# EAGLE design chipset (EAGLE 9.2.2)
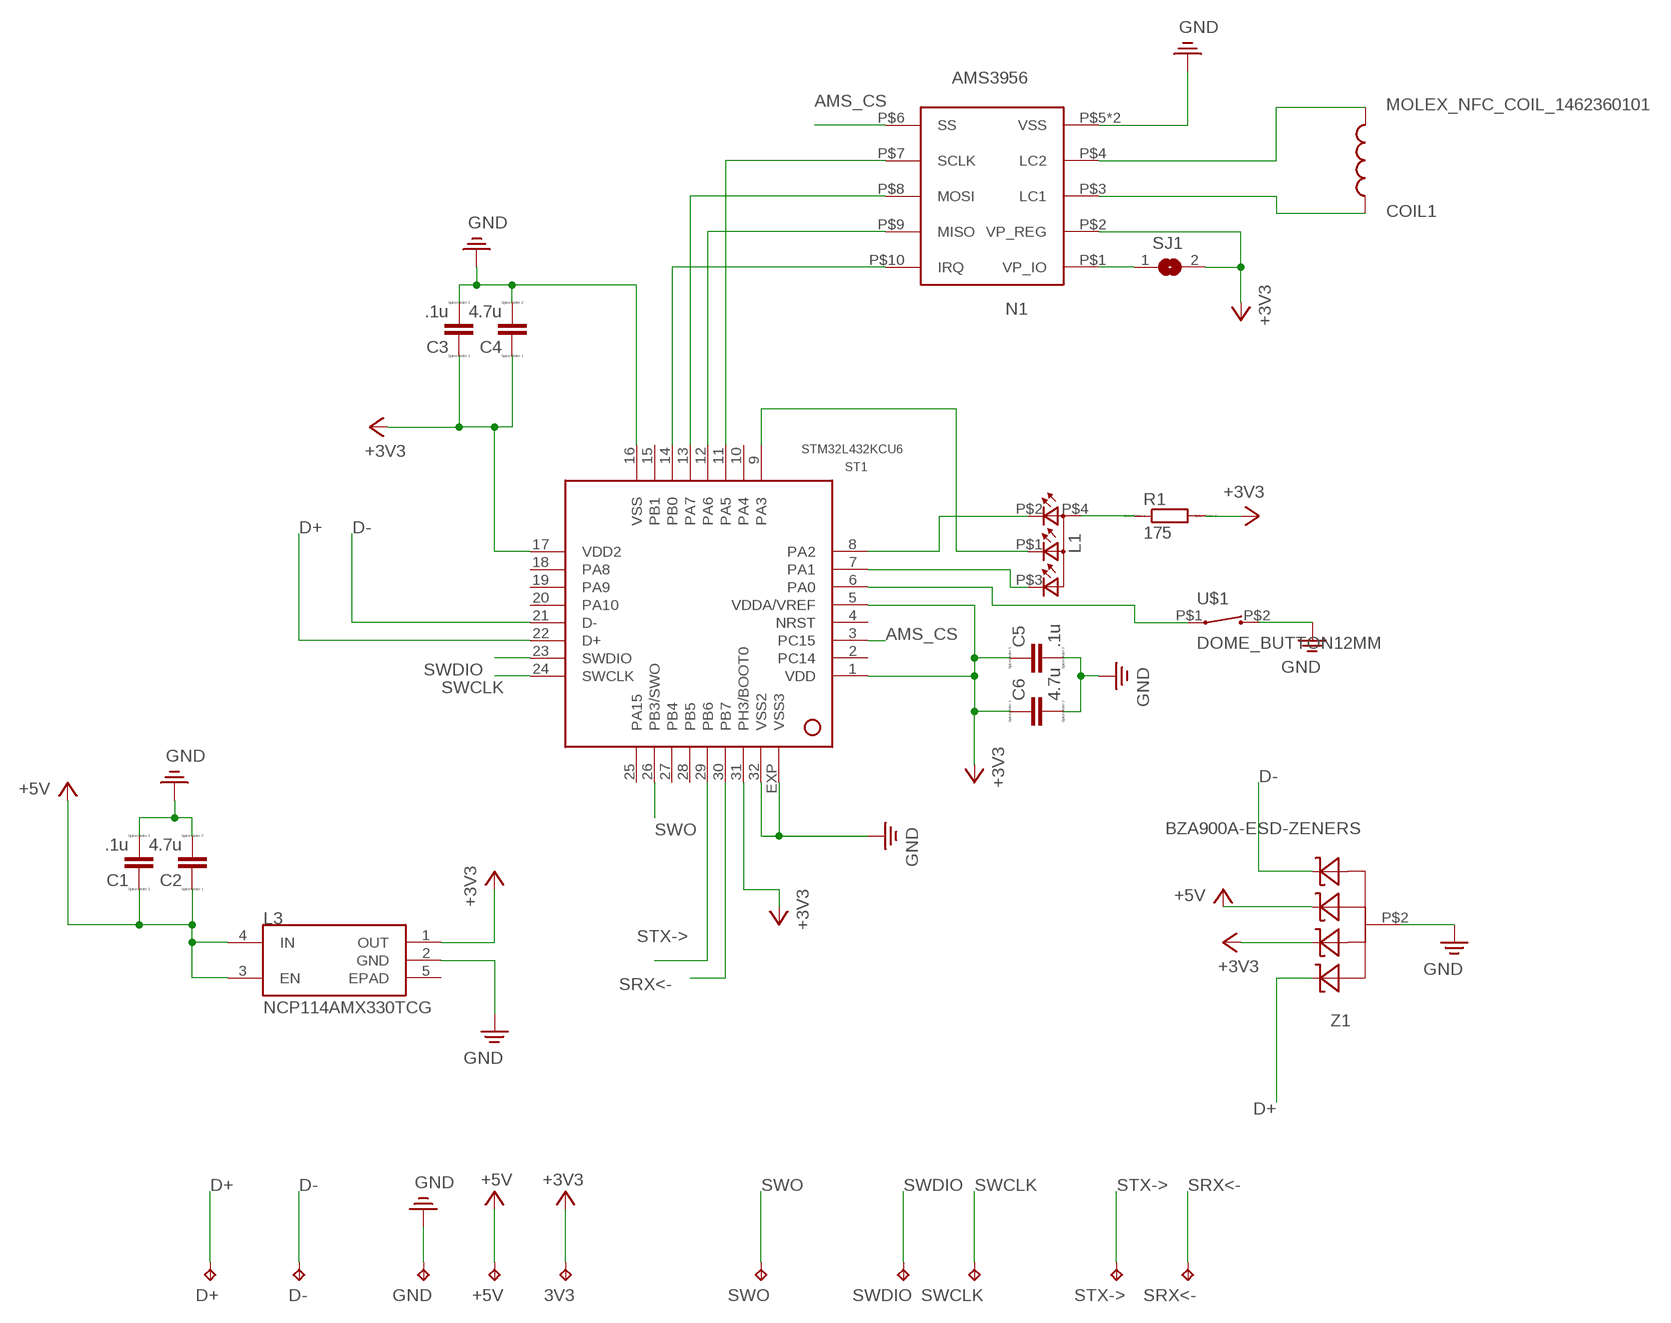
[diagram p0: schematic, sheet 1]

## Parts
3V3  TEST_POINT  [B1,27]
+5V  TEST_POINT  [B1,27]
C1  .1u  CAPACITOR  [C0402]
C2  4.7u  CAPACITOR  [C0402]
C3  .1u  CAPACITOR  [C0402]
C4  4.7u  CAPACITOR  [C0402]
C5  .1u  CAPACITOR  [C0402]
C6  4.7u  CAPACITOR  [C0402]
COIL1  MOLEX_NFC_COIL_1462360101  [MOLEX_NFC_COIL1]
D+  TEST_POINT  [B1,27]
D-  TEST_POINT  [B1,27]
GND  TEST_POINT  [B1,27]
L1  EAST1616RGBA3-LED-RGBCL-505S-X-SD-T  [CL-505S-X-SD-T]
L3  NCP114AMX330TCG  [REG_NCP114AMX330TCG]
N1  AMS3956  [MLPD3X3]
R1  175  RESISTOR  [R0402]
SJ1  SJ  [SJ]
SRX<-  TEST_POINT  [B1,27]
ST1  STM32L432KCU6  [QFN32]
STX->  TEST_POINT  [B1,27]
SWCLK  TEST_POINT  [B1,27]
SWDIO  TEST_POINT  [B1,27]
SWO  TEST_POINT  [B1,27]
U$1  DOME_BUTTON12MM  [DOME-BL-12MM]
Z1  BZA900A-ESD-ZENERS  [BZA900A]

## Nets
+3V3: 3V3.TP C3.1 C4.1 C5.1 C6.1 L3.1(OUT) N1.P$2(VP_REG) R1.2 SJ1.2 ST1.1(VDD) ST1.5(VDDA/VREF) ST1.17(VDD2) ST1.31(PH3/BOOT0) Z1.P$5(C1)
+5V: +5V.TP C1.1 C2.1 L3.3(EN) L3.4(IN) Z1.P$1(C)
AMS_CS: N1.P$6(SS) ST1.3(PC15)
D+: D+.TP ST1.22(D+) Z1.P$3(C3)
D-: D-.TP ST1.21(D-) Z1.P$4(C2)
N$1: L1.P$3(CGREEN) ST1.7(PA1)
N$2: L1.P$1(CBLUE) ST1.9(PA3)
N$3: L1.P$2(CRED) ST1.8(PA2)
N$5: ST1.6(PA0) U$1.P$1
N$6: L1.P$4(A2) R1.1
N$7: N1.P$1(VP_IO) SJ1.1
N$8: N1.P$7(SCLK) ST1.11(PA5)
N$9: N1.P$8(MOSI) ST1.13(PA7)
N$10: N1.P$9(MISO) ST1.12(PA6)
N$11: N1.P$10(IRQ) ST1.14(PB0)
N$12: COIL1.P$2 N1.P$4(LC2)
N$13: COIL1.P$1 N1.P$3(LC1)
PE: C1.2 C2.2 C3.2 C4.2 C5.2 C6.2 GND.TP L3.2(GND) N1.P$5(VSS) N1.P$11(VSS) ST1.16(VSS) ST1.32(VSS2) ST1.EXP(VSS3) U$1.P$2 Z1.P$2 ; supply symbol labelled GND
SRX<-: SRX<-.TP ST1.30(PB7)
STX->: ST1.29(PB6) STX->.TP
SWCLK: ST1.24(SWCLK) SWCLK.TP
SWDIO: ST1.23(SWDIO) SWDIO.TP
SWO: ST1.26(PB3/SWO) SWO.TP
Unconnected: L3.5(EPAD) ST1.2(PC14) ST1.4(NRST) ST1.10(PA4) ST1.15(PB1) ST1.18(PA8) ST1.19(PA9) ST1.20(PA10) ST1.25(PA15) ST1.27(PB4) ST1.28(PB5)

## Library data of the parts
3V3 +5V D+ D- GND SRX<- STX-> SWCLK SWDIO SWO = efm-fido:TEST_POINT
C1-C6 = efm-fido:CAPACITOR
COIL1 = efm-fido:MOLEX_NFC_COIL_1462360101; LINK: https://www.mouser.com/ProductDetail/538-146236-0101; MPN: 1462360101
L1 = efm-fido:EAST1616RGBA3-LED-RGB: EAST1616RGBA3
L3 = efm-fido:NCP114AMX330TCG: CMOS Low Dropout Regulator, 300 mA 3.3V, Active Discharge; AVAILABILITY: Unavailable; DESCRIPTION: CMOS Low Dropout Regulator _LDO_, 300 mA 3.3V, Active Discharge; MF: ON Semiconductor; MP: NCP114AMX330TCG; PACKAGE: UDFN-4 ON Semiconductor; PRICE: None
N1 = efm-fido:AMS3956
R1 = efm-fido:RESISTOR
SJ1 = jumper:SJ: SMD solder JUMPER
ST1 = efm-fido:STM32L432KCU6
U$1 = efm-fido:DOME_BUTTON
Z1 = efm-fido:BZA900A-ESD-ZENERS

## Net classes
0 default: width 0.152 mm, drill 0.203 mm, clearance 0.102 mm

## Board
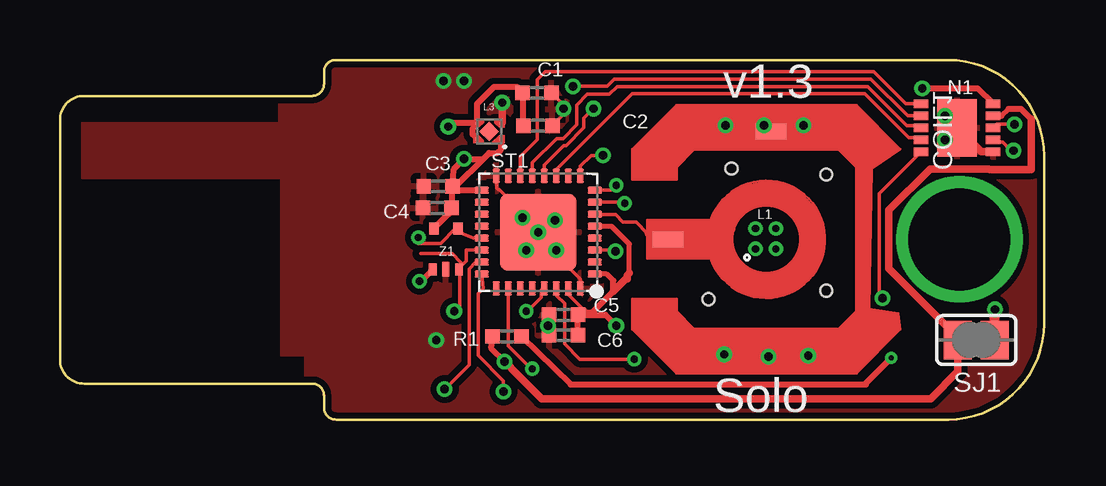
[diagram p1: board, top side]
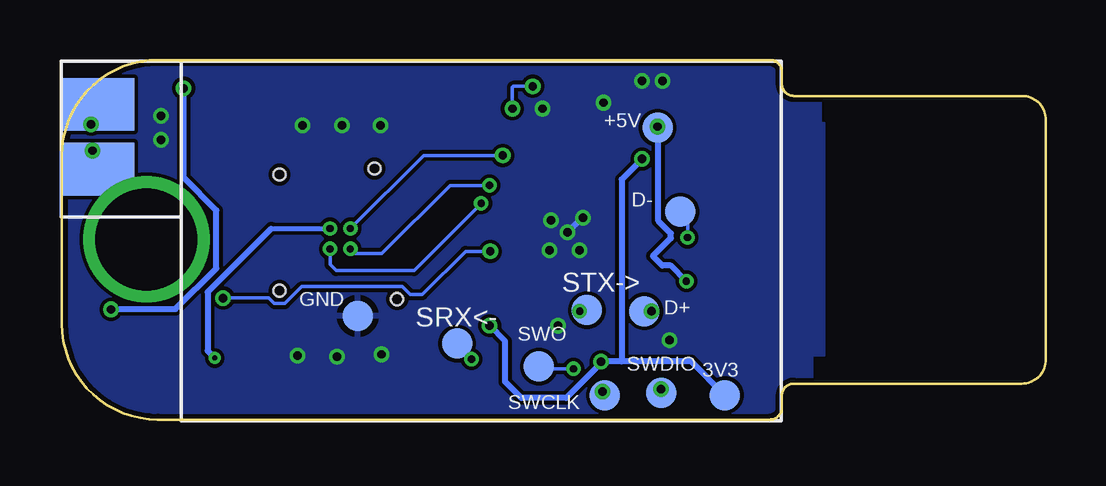
[diagram p2: board, bottom side, seen from below]

Size 41 x 15 mm. Coordinates in mm from the lower left corner, seen from the top.
Outline: 0,2.5 0,12.5 arc-90 1,13.5 10.5,13.5 arc90 11,14 11,14.5 arc-90 11.5,15 37,15 arc-90 41,11 41,4 arc-90 37,0 11.5,0 arc-90 11,0.5 11,1 arc90 10.5,1.5 1,1.5 arc-90 0,2.5
Copper layers (1*16): Top 0.035mm / dielectric 2.2mm / Bottom 0.035mm
Design rules "default *": minimum track width 4mil, minimum drill 0.2mm, track to track 6mil, track to pad 6mil, pad to pad 6mil, via to via 6mil, smd to smd 6mil, copper to edge 8mil, drill to drill 6mil, minimum pad ring 10mil, minimum via ring 0.15mm, stop-mask expansion 4mil, vias tented up to drill 0mil, thermal gap 10mil
Holes 0.5 mm at 27.03,5.02 31.93,5.37 31.93,10.22 27.98,10.47

### Footprints (pad centres in the part's own frame; a part is rotated, then mirrored left to right if it is on the bottom)
B1,27 = smd 1.27 x 1.27: TP 0,0
C0402 = smd 0.6 x 0.6: 1 -0.6,0; 2 0.6,0
MOLEX_NFC_COIL1 = smd 2.2 x 3.1: P$1 13.43,28.5; P$2 10.73,28.5
CL-505S-X-SD-T = smd 0.4 x 0.4: P$1 0.85,0; P$2 0.85,0.85; P$3 0,0.85; P$4 0,0
REG_NCP114AMX330TCG = smd 0.1 x 0.1: 1 -0.325,-0.5; 2 0.325,-0.5; 3 0.325,0.5; 4 -0.325,0.5 | smd 0.58 x 0.58 rotated 45: 5 0,0
MLPD3X3 = smd 0.35 x 0.6: P$1 0,0; P$2 0.5,0; P$3 1,0; P$4 1.5,0; P$5 2,0; P$6 2,-3; P$7 1.5,-3; P$8 1,-3; P$9 0.5,-3; P$10 0,-3 | smd 2.38 x 1.65: P$11 1,-1.5
R0402 = smd 0.6 x 0.6: 1 -0.6,0; 2 0.6,0
SJ = smd 1.168 x 1.6: 1 -0.762,0; 2 0.762,0
QFN32 = smd 0.6 x 0.3: 1 -2.35,1.75; 2 -2.35,1.25; 3 -2.35,0.75; 4 -2.35,0.25; 5 -2.35,-0.25; 6 -2.35,-0.75; 7 -2.35,-1.25; 8 -2.35,-1.75; 17 2.35,-1.75; 18 2.35,-1.25; 19 2.35,-0.75; 20 2.35,-0.25; 21 2.35,0.25; 22 2.35,0.75; 23 2.35,1.25; 24 2.35,1.75 | smd 0.3 x 0.6: 9 -1.75,-2.35; 10 -1.25,-2.35; 11 -0.75,-2.35; 12 -0.25,-2.35; 13 0.25,-2.35; 14 0.75,-2.35; 15 1.25,-2.35; 16 1.75,-2.35; 25 1.75,2.35; 26 1.25,2.35; 27 0.75,2.35; 28 0.25,2.35; 29 -0.25,2.35; 30 -0.75,2.35; 31 -1.25,2.35; 32 -1.75,2.35 | smd 3.2 x 3.2: EXP 0,0
DOME-BL-12MM = smd 1.27 x 0.635: P$1 -4.1,0; P$2 0.2,4.5
BZA900A = smd 0.325 x 0.5: P$1 -0.05,0; P$3 1.05,0 | smd 0.3 x 0.6: P$2 0.5,0 | smd 0.4 x 0.5: P$4 1,1.7; P$5 0,1.7

### Placement (x,y rotation side)
3V3  13.38,1.02 0 bottom
+5V  16.18,12.17 0 bottom
C1  19.88,13.63 0 top
C2  19.92,12.26 0 top
C3  15.76,9.73 180 top
C4  15.72,8.83 180 top
C5  20.98,4.37 180 top
C6  20.98,3.52 180 top
COIL1  11.03,-0.28 90 bottom
D+  16.73,4.52 0 bottom
D-  15.23,8.67 0 bottom
GND  28.68,4.32 0 bottom
L1  29.83,7.97 180 top
L3  17.88,12.02 90 top
N1  38.88,13.17 270 top
R1  18.63,3.47 180 top
SJ1  38.18,3.32 180 top
SRX<-  24.53,3.17 0 bottom
ST1  19.93,7.82 180 top
STX->  19.13,4.57 0 bottom
SWCLK  18.38,1.02 0 bottom
SWDIO  16.03,1.12 0 bottom
SWO  21.13,2.22 0 bottom
U$1  29.43,7.52 0 top
Z1  15.58,6.27 0 top

### Tracks (layer width: path | path; a pad name or v marks a point on that pad's centre or on a via)
+3V3  (via drill 0.35)
  Top 0.152: 21.11,5.45 ST1.31 21.18,5.22 21.83,4.57
  Top 0.203: 22.23,4.47 22.18,4.47 | 23.05,5.79 22.78,6.07 ST1.1 | ST1.5 22.98,8.07 23.73,7.32 23.73,6.12 | 39.23,12.67 39.53,12.97
  Top 0.254: 17.88,3.37 R1.2 17.98,2.97 v18.53,2.42 | C3.1 16.57,9.57 ST1.17 | 17.63,10.87 16.49,9.73 C3.1 | L3.1 18.38,11.27 18.23,11.12 17.88,11.12 17.63,10.87 | C3.1 16.41,10.45 v16.83,10.87 17.63,10.87 | C3.1 16.37,9.69 C4.1 16.37,8.65 16.18,8.57 Z1.P$5 | 23.05,5.79 23.05,5.34 22.18,4.47 21.73,4.47 | 21.73,4.47 21.83,4.57 | 21.73,4.47 21.68,4.42 C5.1 | C5.1 22.73,4.37 v23.18,3.92 | C6.1 C5.1 | 38.91,12.7 N1.P$2 39.23,12.67 | 39.53,12.97 40.03,12.97 40.47,12.53
  Top 0.305: 23.05,5.34 23.58,5.87 23.63,5.87 23.63,6.02 23.73,6.12 | v18.53,2.42 19.07,1.87 20.07,0.87 36.28,0.87 37.42,2.01 SJ1.2 37.42,3.42 34.54,6.3 34.54,8.73 36.26,10.46 38.69,10.46 38.73,10.42 40.47,10.42 40.47,12.53
  Bottom 0.254: 17.68,2.42 14.78,2.42 3V3.TP | 17.68,2.42 v18.53,2.42 18.53,2.37 19.99,0.9 21.86,0.9 22.53,1.57 22.53,3.27 v23.18,3.92 | v16.83,10.87 17.68,10.02 17.68,2.42
+5V  (via drill 0.3, 0.35)
  Top 0.152: 17.38,12.4 17.38,12.37 L3.3 17.38,12.3
  Top 0.203: C1.1 19.22,13.62 | 17.38,11.75 L3.4 17.43,11.64
  Top 0.254: L3.4 17.38,11.71 17.19,11.9 17.19,12.13 17.38,12.32 17.38,12.37 17.38,13.17 18.08,13.87 19.04,13.87 C1.1 19.28,12.3 C2.1 | L3.3 17.35,12.37 16.33,12.37 v16.18,12.22 | Z1.P$1 15.08,5.77 v14.98,5.77
  Bottom 0.152: +5V.TP v16.18,12.22
  Bottom 0.254: 16.33,12.07 v16.18,12.22 16.14,12.18 16.14,8.28 15.63,7.77 15.63,7.57 16.38,6.82 15.98,6.42 15.63,6.42 v14.98,5.77
AMS_CS  (via drill 0.35)
  Top 0.152: N1.P$6 34.13,9.42 34.13,5.22 v34.28,5.07 | v23.15,7.02 23.1,7.07 ST1.3
  Bottom 0.152: v34.28,5.07 32.38,5.07 32.15,4.84 31.71,4.84 31,5.55 26.81,5.55 26.48,5.22 25.98,5.22 24.18,7.02 v23.15,7.02
D+  (via drill 0.35)
  Top 0.152: ST1.22 16.93,7.07 16.93,6.62 16.63,6.32 Z1.P$3 | Z1.P$3 16.66,6.26 16.66,4.75 v16.43,4.52 | 15.03,6.92 16.35,6.92 16.71,6.56 16.71,6.35 Z1.P$3
  Bottom 0.254: D+.TP v16.43,4.52
D-  (via drill 0.3)
  Top 0.152: ST1.21 17.22,7.57 16.8,7.74 Z1.P$4 16.48,7.97 15.85,7.34 14.93,7.34 v14.93,7.59
  Bottom 0.152: v14.93,7.59 14.93,8.37 D-.TP
N$1  (via drill 0.3)
  Top 0.152: ST1.7 23.48,9.07 v23.53,9.02
  Bottom 0.152: v23.53,9.02 26.33,6.22 29.58,6.22 29.83,6.47 L1.P$3
  other vias: 29.83,7.12
N$2  (via drill 0.3, 0.35)
  Top 0.152: v22.63,11.02 22.13,11.02 21.68,10.57 ST1.9
  Bottom 0.152: v22.63,11.02 25.93,11.02 L1.P$1
  other vias: 28.98,7.97
N$3  (via drill 0.3)
  Top 0.152: ST1.8 22.98,9.57 v23.18,9.77
  Bottom 0.152: v23.18,9.77 24.83,9.77 27.68,6.92 28.83,6.92 28.88,6.97 28.88,7.02 L1.P$2
  other vias: 28.98,7.12
N$4  (via drill 4.25)
  other vias: 37.48,7.52
N$5
  Top 0.152: ST1.6 22.25,8.55 23.15,8.55 23.45,8.24 24,8.24 24.47,7.76 25.34,7.76 | 24.63,7.47 24.65,7.49 24.7,7.49 24.75,7.49 24.72,7.52 | U$1.P$1 24.72,7.52 | 24.72,7.52 24.7,7.54
  Top 0.254: 24.47,7.76 24.7,7.54 24.7,7.49
N$6  (via drill 0.2, 0.3)
  Top 0.152: L1.P$4 29.93,7.97
  Top 0.254: R1.1 21.28,1.47 33.58,1.47 33.58,1.52 v34.63,2.57
  Bottom 0.2: 32.28,7.97 L1.P$4
  Bottom 0.254: v34.63,2.57 34.93,2.87 34.93,5.32 32.28,7.97
  other vias: 29.83,7.97
N$7  (via drill 0.35)
  Top 0.254: v35.93,13.82 38.23,13.82 N1.P$1
  Top 0.406: SJ1.1 38.94,4.58 v38.95,4.59
  Bottom 0.254: v35.93,13.82 35.93,10.09 34.57,8.72 34.57,6.31 36.27,4.61 v38.94,4.61 v38.95,4.59
N$8
  Top 0.152: N1.P$7 35.78,11.76 35.36,11.76 33.53,13.59 23.84,13.59 20.68,10.43 ST1.11
N$9
  Top 0.152: N1.P$8 35.78,12.26 35.29,12.26 33.66,13.9 23.22,13.9 22.89,13.57 21.98,13.57 21.53,13.12 21.53,12.29 20.96,11.73 20.69,11.73 19.68,10.72 ST1.13
N$10  (via drill 0.35)
  Top 0.152: N1.P$9 35.31,12.67 33.78,14.2 23.09,14.2 22.79,13.9 v21.38,13.9 | v22.23,12.97 21.83,12.57 21.83,12.17 21.09,11.42 20.98,11.42 20.18,10.62 ST1.12
  Bottom 0.152: v21.38,13.9 22.19,13.9 22.23,13.87 v22.23,12.97
N$11
  Top 0.152: N1.P$10 35.25,13.17 33.91,14.51 20.22,14.51 19.89,14.18 19.89,11.68 19.18,10.97 ST1.14
N$12  (via drill 0.35)
  Top 0.152: N1.P$4 38.97,11.57 39.27,11.57 39.58,11.27 39.68,11.27 v39.73,11.22
  Bottom 0.152: v39.73,11.22 39.68,11.17 39.68,10.6 COIL1.P$2
N$13  (via drill 0.35)
  Top 0.152: v39.78,12.32 39.03,12.32 N1.P$3
  Bottom 0.152: v39.78,12.32 39.53,12.57 COIL1.P$1
PE  (via drill 0.35)
  Top 0.152: ST1.32 21.68,5.87 20.23,7.32 20.23,7.52 | ST1.16 18.2,10.1 18.2,9.65 18.26,9.59 18.31,9.59 19.93,7.97 ST1.EXP | C6.2 v20.33,3.92 | L3.2 18.43,12.39 | C2.2 20.97,12.71 v20.97,12.97 20.97,13.13 C1.2 | N1.P$11 37.88,12.67 | N1.P$11 v36.88,12.67 | N1.P$11 v36.88,11.67
  Top 0.254: v19.28,8.42 19.33,8.42 ST1.EXP 20.23,7.52 v20.68,7.07 | v20.63,8.32 19.43,8.32 v19.43,7.07 | v20.33,3.92 C5.2
  Top 0.305: N1.P$11 38.38,11.17 N1.P$5 | 18.43,12.39 v18.43,13.22
  Bottom 0.254: 20.03,7.82 ST1.EXP 19.33,8.42 v19.28,8.42
  other vias: 19.93,7.82 27.73,12.27 29.33,12.27 30.98,12.27 27.68,2.72 29.53,2.62 31.18,2.67 16.83,14.12 15.98,14.12 15.68,3.32
  pour Top (isolate 0.254): 0.93,10.07 0.93,12.37 9.13,12.37 9.13,18.07 41.83,18.07 41.83,-1.03 10.23,-1.03 10.23,2.67 9.23,2.67 9.23,10.07
  pour Bottom: 9.23,12.37 9.38,12.37 9.38,16.97 42.63,16.97 42.63,-1.73 9.73,-1.73 9.73,2.67 9.23,2.67
SRX<-  (via drill 0.3)
  Top 0.152: ST1.30 20.7,5.5 20.7,5.17 21.02,4.84 21.02,3.15 21.65,2.52 v23.93,2.52
  Bottom 0.152: v23.93,2.52 24.53,3.12 SRX<-.TP
STX->  (via drill 0.3)
  Top 0.152: ST1.29 20.06,5.4 20.06,5.1 19.48,4.52 v19.43,4.52 19.32,4.42
  Bottom 0.152: STX->.TP 19.18,4.52 v19.43,4.52
SWCLK  (via drill 0.35)
  Top 0.152: v18.48,1.17 18.48,1.62 17.43,2.67 17.43,5.27 17.63,5.47 ST1.24
  Bottom 0.152: v18.48,1.17 18.43,1.22
  Bottom 0.254: SWCLK.TP 18.53,1.17 v18.48,1.17
SWDIO  (via drill 0.35)
  Top 0.152: ST1.23 17.61,6.55 17.31,6.55 17.05,6.29 17.05,2.29 v16.03,1.27
  Bottom 0.152: 16.03,1.32 v16.03,1.27 SWDIO.TP
SWO  (via drill 0.3)
  Top 0.152: 18.68,5.27 18.65,5.3 18.65,5.49 ST1.26 18.68,3.07 19.63,2.12 v19.68,2.12
  Bottom 0.152: v19.68,2.12 21.03,2.12 SWO.TP

### Text on the board
tPlace: v1.3 | Solo